# Altium schematic sheet VS1063.SchDoc
size A
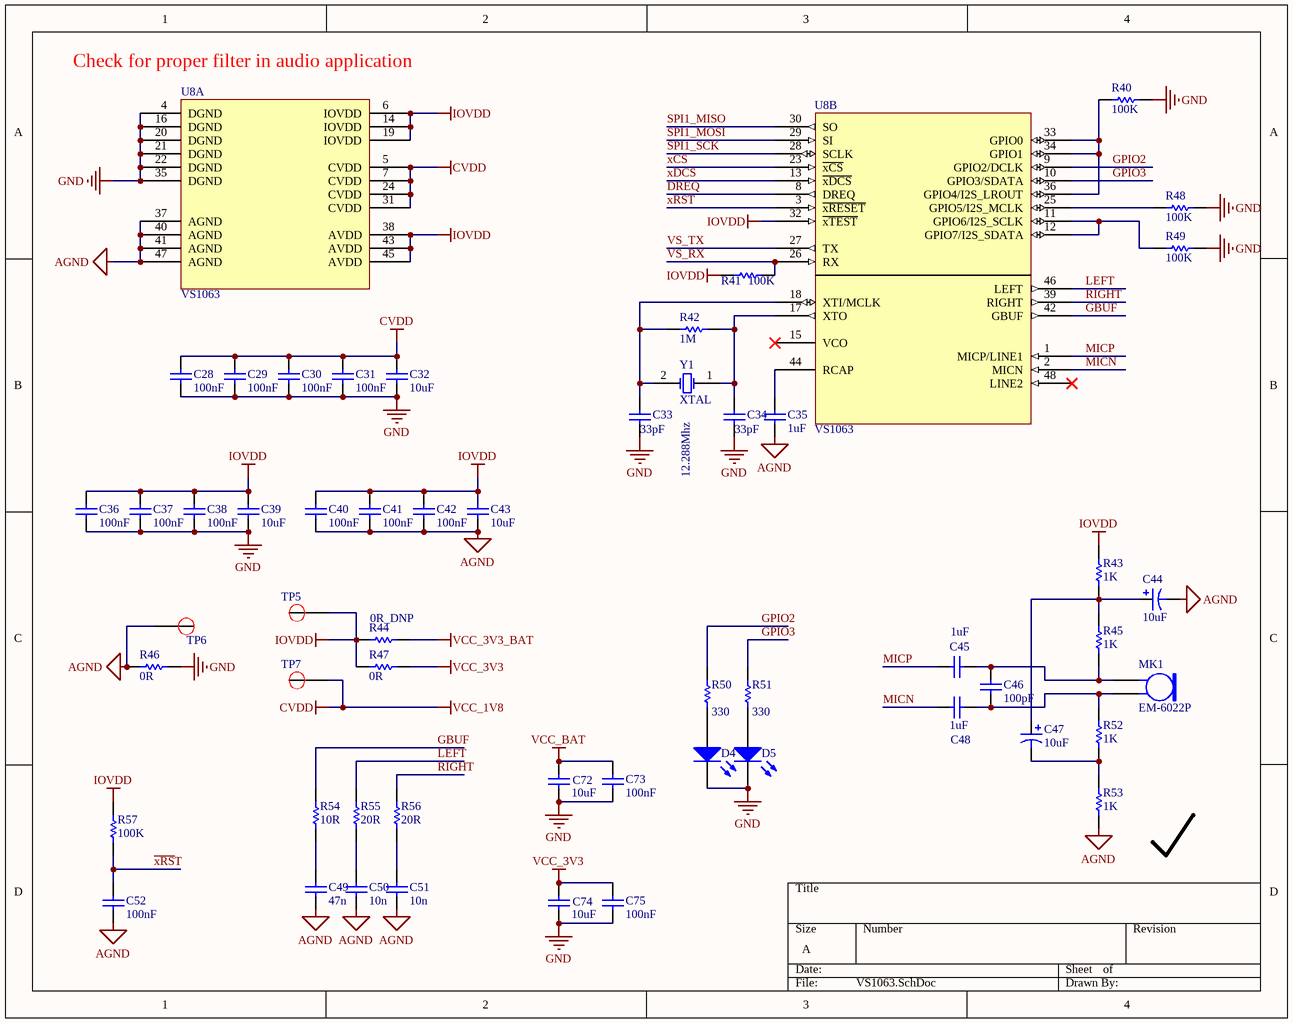
[diagram p0: VS1063.SchDoc]

## Parts
C28  value 100nF  [0603PKG]  (hidden comment: Cap Semi)
C29  value 100nF  [0603PKG]  (hidden comment: Cap Semi)
C30  value 100nF  [0603PKG]  (hidden comment: Cap Semi)
C31  value 100nF  [0603PKG]  (hidden comment: Cap Semi)
C32  value 10uF  [0603PKG]  (hidden comment: Cap Semi)
C33  value 33pF  [0603PKG]  (hidden comment: Cap)
C34  value 33pF  [0603PKG]  (hidden comment: Cap)
C35  value 1uF  [0603PKG]  (hidden comment: Cap Semi)
C36  value 100nF  [0603PKG]  (hidden comment: Cap Semi)
C37  value 100nF  [0603PKG]  (hidden comment: Cap Semi)
C38  value 100nF  [0603PKG]  (hidden comment: Cap Semi)
C39  value 10uF  [0603PKG]  (hidden comment: Cap Semi)
C40  value 100nF  [0603PKG]  (hidden comment: Cap Semi)
C41  value 100nF  [0603PKG]  (hidden comment: Cap Semi)
C42  value 100nF  [0603PKG]  (hidden comment: Cap Semi)
C43  value 10uF  [0603PKG]  (hidden comment: Cap Semi)
C44  value 10uF  [3216X18N]  (hidden comment: Cap Pol3)
C45  value 1uF  [0603PKG]  (hidden comment: Cap Semi)
C46  value 100pF  [0603PKG]  (hidden comment: Cap Semi)
C47  value 10uF  [3216X18N]  (hidden comment: Cap Pol3)
C48  value 1uF  [0603PKG]  (hidden comment: Cap Semi)
C49  value 47n  [C0805]  (hidden comment: Cap Semi)
C50  value 10n  [C0805]  (hidden comment: Cap Semi)
C51  value 10n  [C0805]  (hidden comment: Cap Semi)
C52  value 100nF  [0603PKG]  (hidden comment: Cap Semi)
C72  value 10uF  [C0805]  (hidden comment: Cap Semi)
C73  value 100nF  [C0805]  (hidden comment: Cap Semi)
C74  value 10uF  [C0805]  (hidden comment: Cap Semi)
C75  value 100nF  [C0805]  (hidden comment: Cap Semi)
D4  LED0  [C0805]  (value not drawn)
D5  LED0  [C0805]  (value not drawn)
MK1  EM-6022P  [Microphone]
R40  value 100K  [0603PKG]  (hidden comment: Res1)
R41  value 100K  [0603PKG]  (hidden comment: Res1)
R42  value 1M  [0603PKG]  (hidden comment: Res1)
R43  value 1K  [0603PKG]  (hidden comment: Res1)
R44  value 0R_DNP  [0603PKG]  (hidden comment: Res1)
R45  value 1K  [0603PKG]  (hidden comment: Res1)
R46  value 0R  [0603PKG]  (hidden comment: Res1)
R47  value 0R  [0603PKG]  (hidden comment: Res1)
R48  value 100K  [0603PKG]  (hidden comment: Res1)
R49  value 100K  [0603PKG]  (hidden comment: Res1)
R50  value 330  [0603PKG]  (hidden comment: Res Semi)
R51  value 330  [0603PKG]  (hidden comment: Res Semi)
R52  value 1K  [0603PKG]  (hidden comment: Res1)
R53  value 1K  [0603PKG]  (hidden comment: Res1)
R54  value 10R  [C0805]  (hidden comment: Res1)
R55  value 20R  [C0805]  (hidden comment: Res1)
R56  value 20R  [C0805]  (hidden comment: Res1)
R57  value 100K  [0603PKG]  (hidden comment: Res1)
TP5  TP  [TP_15]  (value not drawn)
TP6  TP  [TP_15]  (value not drawn)
TP7  TP  [TP_15]  (value not drawn)
U8  VS1063  [LQFP48]  (parts A,B of 2)
Y1  XTAL  value 12.288Mhz  [SMD_Crystal]

## Nets
AGND: C35.1 C40.1 C41.1 C42.1 C43.1 C44.2 C49.2 C50.2 C51.2 C52.2 R46.2 R53.2 TP6.1 U8.37(AGND) U8.40(AGND) U8.41(AGND) U8.47(AGND)
CVDD: C28.2 C29.2 C30.2 C31.2 C32.2 TP7.1 U8.5(CVDD) U8.7(CVDD) U8.24(CVDD) U8.31(CVDD)  [also labelled VCC_1V8]
GND: C28.1 C29.1 C30.1 C31.1 C32.1 C33.1 C34.1 C36.1 C37.1 C38.1 C39.1 C72.1 C73.1 C74.1 C75.1 D4.2(K) D5.2(K) R40.1 R46.1 R48.1 R49.1 U8.4(DGND) U8.16(DGND) U8.20(DGND) U8.21(DGND) U8.22(DGND) U8.35(DGND)
IOVDD: C36.2 C37.2 C38.2 C39.2 C40.2 C41.2 C42.2 C43.2 R41.2 R43.1 R44.2 R47.2 R57.1 TP5.1 U8.6(IOVDD) U8.14(IOVDD) U8.19(IOVDD) U8.32(~{xTEST}) U8.38(AVDD) U8.43(AVDD) U8.45(AVDD)
VCC_3V3: C74.2 C75.2 R47.1
VCC_3V3_BAT: R44.1
VCC_BAT: C72.2 C73.2
DREQ: U8.8(DREQ)
GBUF: R54.1 U8.42(GBUF)
GPIO2: R50.2 U8.9(GPIO2/DCLK)
GPIO3: R51.2 U8.10(GPIO3/SDATA)
LEFT: R55.1 U8.46(LEFT)
MICN: C48.1 U8.2(MICN)
MICP: C45.1 U8.1(MICP/LINE1)
RIGHT: R56.1 U8.39(RIGHT)
SPI1_MISO: U8.30(SO)
SPI1_MOSI: U8.29(SI)
SPI1_SCK: U8.28(SCLK)
VS_RX: R41.1 U8.26(RX)
VS_TX: U8.27(TX)
~{xCS}: U8.23(~{xCS})
~{xDCS}: U8.13(~{xDCS})
~{xRS}T: C52.1 R57.2 U8.3(~{xRESET})
NetC33_2: C33.2 R42.2 U8.18(XTI/MCLK) Y1.2(OSC2)
NetC34_2: C34.2 R42.1 U8.17(XTO) Y1.1(OSC1)
NetC35_2: C35.2 U8.44(RCAP)
NetC44_1: C44.1 C47.1 R43.2 R45.1
NetC45_2: C45.2 C46.2 MK1.1 R45.2
NetC46_1: C46.1 C48.2 MK1.2 R52.1
NetC47_2: C47.2 R52.2 R53.1
NetC49_1: C49.1 R54.2
NetC50_1: C50.1 R55.2
NetC51_1: C51.1 R56.2
NetD4_1: D4.1(A) R50.1
NetD5_1: D5.1(A) R51.1
NetR40_2: R40.2 U8.33(GPIO0) U8.34(GPIO1) U8.36(GPIO4/I2S_LROUT)
NetR48_2: R48.2 U8.25(GPIO5/I2S_MCLK)
NetR49_2: R49.2 U8.11(GPIO6/I2S_SCLK) U8.12(GPIO7/I2S_SDATA)

Not connected (* = marked no-connect by the designer): U8 15(VCO)* 48(LINE2)*

## Notes on the sheet
- (near U8) Check for proper filter in audio application

## Library data of the parts
C28-C32 C35-C43 C45 C46 C48-C52 C72-C75 = Cap Semi: Capacitor (Semiconductor SIM Model); Published: 8-Jun-2000; LatestRevisionDate: 29-May-2009; LatestRevisionNote: IPC-7351 Footprint Added.; PackageReference: C1206; Publisher: Altium Limited; PackageDescription: Chip Capacitor
C33 C34 = Cap: Capacitor; Published: 8-Jun-2000; LatestRevisionDate: 17-Jul-2002; LatestRevisionNote: Re-released for DXP Platform.; PackageReference: RAD-0.3; Publisher: Altium Limited; PackageDescription: Radial Cap, Thru-Hole; 2 Leads; 0.3 in Pin Spacing
C44 C47 = Cap Pol3: Polarized Capacitor (Surface Mount); Published: 8-Jun-2000; LatestRevisionDate: 29-May-2009; LatestRevisionNote: IPC-7351 Footprint Added.; PackageReference: C0805; Publisher: Altium Limited; PackageDescription: Chip Capacitor
D4 D5 = LED0: Typical INFRARED GaAs LED; Published: 8-Jun-2000; LatestRevisionDate: 08-Jul-2005; LatestRevisionNote: Mech Layer 1 removed.; PackageReference: LED-0; Publisher: Altium Limited; PackageDescription: LED; 2 Leads
MK1 = Mic2: Microphone; Published: 24-Mar-1999; LatestRevisionDate: 17-Jul-2002; LatestRevisionNote: Re-released for DXP Platform.; PackageReference: PIN2; Publisher: Altium Limited
R40-R49 R52-R57 = Res1: Resistor; Published: 8-Jun-2000; LatestRevisionDate: 17-Jul-2002; LatestRevisionNote: Re-released for DXP Platform.; PackageReference: AXIAL-0.3; Publisher: Altium Limited; PackageDescription: Axial Device, Thru-Hole; 2 Leads; 0.3 in Pin Spacing
R50 R51 = Res Semi: Semiconductor Resistor; Published: 8-Jun-2000; LatestRevisionDate: 17-Jul-2002; LatestRevisionNote: Re-released for DXP Platform.; PackageReference: AXIAL-0.5; Publisher: Altium Limited; PackageDescription: Axial Device, Thru-Hole; 2 Leads; 0.5 in Pin Spacing
TP5-TP7 = Test Point
U8 = VS1063: Audion Codec
Y1 = XTAL: Crystal Oscillator; Published: 8-Jun-2000; LatestRevisionDate: 17-Jul-2002; LatestRevisionNote: Re-released for DXP Platform.; PackageReference: R38; Publisher: Altium Limited; PackageDescription: Crystal, Thru-Hole; 2 Leads; Body 3.1 x 8.2 mm (Dia.xH)